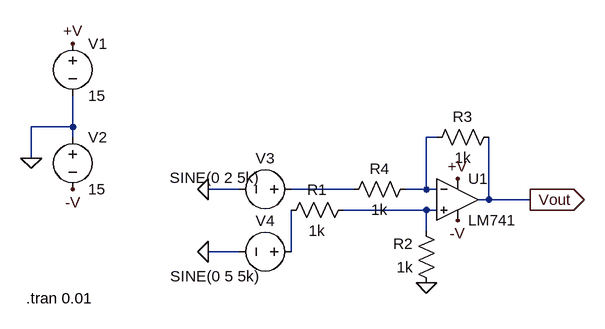
[diagram p0: schematic subtractor.asc]
subtractor.asc, the LTspice schematic file:
Version 4
SHEET 1 880 680
WIRE -80 0 -80 -48
WIRE -80 0 -144 0
WIRE -80 16 -80 0
WIRE 480 16 464 16
WIRE -144 48 -144 0
WIRE 176 96 128 96
WIRE 352 96 256 96
WIRE 464 96 464 16
WIRE 464 96 432 96
WIRE 480 96 464 96
WIRE 560 112 560 16
WIRE 560 112 544 112
WIRE 624 112 560 112
WIRE 464 128 336 128
WIRE 480 128 464 128
WIRE 464 160 464 128
WIRE 176 192 128 192
WIRE 256 192 256 128
FLAG -144 48 0
FLAG -80 -128 +V
FLAG -80 96 -V
FLAG 512 80 +V
FLAG 512 144 -V
FLAG 624 112 Vout
IOPIN 624 112 Out
FLAG 464 240 0
FLAG 128 96 0
FLAG 128 192 0
SYMBOL voltage -80 -144 R0
WINDOW 123 0 0 Left 0
WINDOW 39 0 0 Left 0
SYMATTR InstName V1
SYMATTR Value 15
SYMBOL voltage -80 0 R0
WINDOW 123 0 0 Left 0
WINDOW 39 0 0 Left 0
SYMATTR InstName V2
SYMATTR Value 15
SYMBOL OpAmps\\LM741 512 48 R0
SYMATTR InstName U1
SYMBOL res 352 112 R90
WINDOW 0 0 56 VBottom 2
WINDOW 3 32 56 VTop 2
SYMATTR InstName R1
SYMATTR Value 1k
SYMBOL res 480 256 R180
WINDOW 0 36 76 Left 2
WINDOW 3 36 40 Left 2
SYMATTR InstName R2
SYMATTR Value 1k
SYMBOL res 576 0 R90
WINDOW 0 0 56 VBottom 2
WINDOW 3 32 56 VTop 2
SYMATTR InstName R3
SYMATTR Value 1k
SYMBOL res 448 80 R90
WINDOW 0 0 56 VBottom 2
WINDOW 3 32 56 VTop 2
SYMATTR InstName R4
SYMATTR Value 1k
SYMBOL voltage 272 96 R90
WINDOW 0 -32 56 VBottom 2
WINDOW 3 -33 134 VTop 2
WINDOW 123 0 0 Left 0
WINDOW 39 0 0 Left 0
SYMATTR InstName V3
SYMATTR Value SINE(0 2 5k)
SYMBOL voltage 272 192 R90
WINDOW 0 -32 56 VBottom 2
WINDOW 3 22 133 VTop 2
WINDOW 123 0 0 Left 0
WINDOW 39 0 0 Left 0
SYMATTR InstName V4
SYMATTR Value SINE(0 5 5k)
TEXT -152 264 Left 2 !.tran 0.01

The netlist it stands for:
* subtractor.asc
V1 +V 0 15
V2 0 -V 15
XU1 N003 N001 +V -V Vout LM741  ; pins In+ In- V+ V- OUT
R1 N003 N004 1k
R2 0 N003 1k
R3 Vout N001 1k
R4 N001 N002 1k
V3 N002 0 SINE(0 2 5k)
V4 N004 0 SINE(0 5 5k)
.tran 0.01
.lib LM741.lib
.backanno
.end